# Altium schematic sheet PowerMeter_Cpu.SchDoc: Power Meter - CPU
size A4; Author: SFARA, Gonzalo Agustín; CompanyName: Introducción al Diseño de Circuitos Impresos; Organization: UTN FRBA; Revision: 02; SheetNumber: 4; SheetTotal: 5
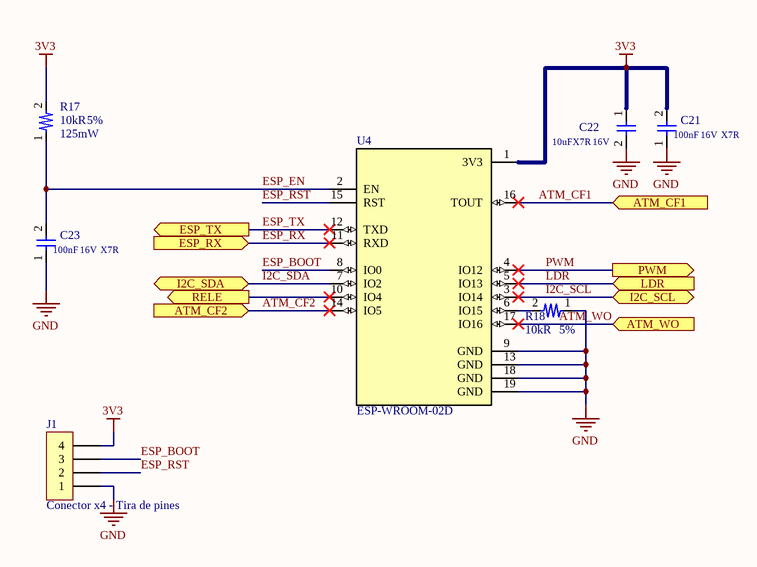
[diagram p0: PowerMeter_Cpu.SchDoc]

## Parts
C21  Capacitance: 100nF  Voltage Rating (DC): 16V  Dielectric: X7R  [C_0805]  (hidden comment: CAP Ceramic  0.1uF 16V X7R)
C22  Capacitance: 10uF  Dielectric: X7R  Voltage Rating: 16V  [C_1206]  (hidden comment: CAP Ceramic  10uF 16V X7R)
C23  Capacitance: 100nF  Voltage Rating (DC): 16V  Dielectric: X7R  [C_0805]  (hidden comment: CAP Ceramic  0.1uF 16V X7R)
J1  Conector x4 - Tira de pines  [Tira de pinesx4]
R17  Resistance: 10kR  Tolerance: 5%  Power Rating: 125mW  [R_0805]  (hidden comment: RES 10kOhm 5% 1/8W)
R18  Resistance: 10kR  Tolerance: 5%  [R_0805]  (hidden comment: RES 10kOhm 5% 1/8W)
U4  ESP-WROOM-02D  [ESP-WROOM-02D]

## Ports
ATM_CF1 (in), ATM_CF2 (in), ATM_WO (in), ESP_RX (in), ESP_TX (out), I2C_SCL (bidir), I2C_SDA (bidir), LDR (in), PWM (out), RELE (out)

## Nets
3V3: C21.2 C22.1 J1.4 R17.2 U4.1(3V3)
GND: C21.1 C22.2 C23.1 J1.1 R18.1 U4.9(GND) U4.13(GND) U4.18(GND) U4.19(GND)
ATM_CF1: U4.16(TOUT) ; port ATM_CF1
ATM_CF2: U4.14(IO5) ; port ATM_CF2
ATM_WO: U4.17(IO16) ; port ATM_WO
ESP_BOOT: J1.3 U4.8(IO0)
ESP_EN: C23.2 R17.1 U4.2(EN)
ESP_RST: J1.2 U4.15(RST)
ESP_RX: U4.11(RXD) ; port ESP_RX
ESP_TX: U4.12(TXD) ; port ESP_TX
I2C_SCL: U4.3(IO14) ; port I2C_SCL
I2C_SDA: U4.7(IO2) ; port I2C_SDA
LDR: U4.5(IO13) ; port LDR
PWM: U4.4(IO12) ; port PWM
RELE: U4.10(IO4) ; port RELE
NetR18_2: R18.2 U4.6(IO15)

## Notes on the sheet
- Title:
- Size:
- Author:
- A4
- Sheet
- of
- Revision:
- File:
- Date:

## Library data of the parts
C21 C23 = CAP_NP: Cap Ceramic 0.1uF 16V X7R 10% SMD 0805 125C Paper T/R; Manufacturer: Yageo; Manufacturer Part Number: CC0805KPX7R7BB104; Supplier 1: Digi-Key; Supplier Part Number 1: 13-CC0805KPX7R7BB104TR-ND; RoHS: Yes; Category: Ceramic Capacitors; Pricing 1: 60000=0,01497 (USD); Case/Package: 0805; Case Code (Imperial): 0805; Case Code (Metric): 2012; Weight: 0.000194oz; Min Operating Temperature: -55°C; Max Operating Temperature: 125°C; Tolerance: 10%; Packaging: Tape and Reel; Termination: SMD/SMT; Resistor Type: Ceramic; Lead Free: Lead Free; Halogen Free: Halogen Free; RoHS Compliant: Yes; ComponentLink1URL: https://datasheet.ciiva.com/13265/upy-gphc-x7r-6-3v-to-50v-8-12304-13265229.pdf?src-supplier=Mouser; ComponentLink1Description: https://datasheet.ciiva.com/13265/upy-gphc-x7r-6-3v-to-50v-8-12304-13265229.pdf?src-supplier=Mouser
C22 = CAP_NP: CL31 Series 1206 10 uF 16 V ±10% Tolerance X7R Multilayer Ceramic Capacitor; Manufacturer: Samsung; Manufacturer Part Number: CL31B106KOHNNNF; Value: *; Supplier 1: Future Electronics; Supplier Part Number 1: 5039552; RoHS: Yes; Category: Ceramic Capacitors; Stock 1: 2000; Pricing 1: 8000=0,04240, 16000=0,03440, 24000=0,03410, 32000=0,03390 (USD); Mount: Surface Mount; Case/Package: 1206; Min Operating Temperature: -55°C; Max Operating Temperature: 125°C; Tolerance: 10%; Packaging: Tape and Reel; Package Quantity: 8000; Voltage Rating (DC): 16V; Series: CL; Construction: Flat; Length: 3.2mm; Width: 0.063inch; Height: 1.6mm; Thickness: 0.071inch; Depth: 1.6mm; Radiation Hardening: No; Lead Free: Lead Free; RoHS Compliant: Yes; ComponentLink1URL: https://datasheet.ciiva.com/25728/cl31b106kohnnnf-25728936.pdf?src-supplier=Digi-Key; ComponentLink1Description: https://datasheet.ciiva.com/25728/cl31b106kohnnnf-25728936.pdf?src-supplier=Digi-Key
J1 = Conector x4
R17 = RES: Res Thick Film 0805 10K Ohm 5% 1/8W ±200ppm/°C Molded SMD SMD Paper T/R; Manufacturer: Vishay Dale; Manufacturer Part Number: CRCW080510K0JNEB; Voltage Rating: 150V; Supplier 1: Future Electronics; Supplier Part Number 1: 2941144; RoHS: Yes; Category: Chip SMD Resistors; Stock 1: 20000; Pricing 1: 10000=0,02140, 20000=0,01740, 30000=0,01730, 40000=0,01720, 50000=0,01710 (USD); Case/Package: 0805; Weight: 0.000194oz; Case Code (Imperial): 0805; Case Code (Metric): 2012; Contact Plating: Tin; Min Operating Temperature: -55°C; Max Operating Temperature: 155°C; Packaging: Tape and Reel; Package Quantity: 10000; Resistor Type: Thick Film; Termination: SMD/SMT; Number of Terminations: 2; Max Power Dissipation: 125mW; Temperature Coefficient: 200ppm/°C; Voltage Rating (DC): 150V; Working Voltage: 150V; Features: Automotive AEC-Q200; Series: CRCW; Construction: Rectangular; Technology: THICK FILM; Resistance Tolerance: 5%; Length: 2mm; Width: 1.25mm; Height: 0.02inch; Depth: 1.25mm; Radiation Hardening: No; REACH SVHC: Unknown; Military Standard: Not; Lead Free: Lead Free; ComponentLink1URL: https://datasheet.ciiva.com/3258/dcrcwe3-3258030.pdf?src-supplier=Avnet; ComponentLink1Description: https://datasheet.ciiva.com/3258/dcrcwe3-3258030.pdf?src-supplier=Avnet; ComponentLink2URL: https://datasheet.ciiva.com/16199/dcrcwe3-16199191.pdf?src-supplier=Future+Electronics; ComponentLink2Description: https://datasheet.ciiva.com/16199/dcrcwe3-16199191.pdf?src-supplier=Future+Electronics; ComponentLink3URL: https://datasheet.ciiva.com/7725/dcrcwe3-7725772.pdf?src-supplier=Element14; ComponentLink3Description: https://datasheet.ciiva.com/7725/dcrcwe3-7725772.pdf?src-supplier=Element14
R18 = RES: Res Thick Film 0805 10K Ohm 5% 1/8W ±200ppm/°C Molded SMD SMD Paper T/R; Manufacturer: Vishay Dale; Manufacturer Part Number: CRCW080510K0JNEB; Voltage Rating: 150V; Power Rating: 125mW; Supplier 1: Future Electronics; Supplier Part Number 1: 2941144; RoHS: Yes; Category: Chip SMD Resistors; Stock 1: 20000; Pricing 1: 10000=0,02140, 20000=0,01740, 30000=0,01730, 40000=0,01720, 50000=0,01710 (USD); Case/Package: 0805; Weight: 0.000194oz; Case Code (Imperial): 0805; Case Code (Metric): 2012; Contact Plating: Tin; Min Operating Temperature: -55°C; Max Operating Temperature: 155°C; Packaging: Tape and Reel; Package Quantity: 10000; Resistor Type: Thick Film; Termination: SMD/SMT; Number of Terminations: 2; Max Power Dissipation: 125mW; Temperature Coefficient: 200ppm/°C; Voltage Rating (DC): 150V; Working Voltage: 150V; Features: Automotive AEC-Q200; Series: CRCW; Construction: Rectangular; Technology: THICK FILM; Resistance Tolerance: 5%; Length: 2mm; Width: 1.25mm; Height: 0.02inch; Depth: 1.25mm; Radiation Hardening: No; REACH SVHC: Unknown; Military Standard: Not; Lead Free: Lead Free; ComponentLink1URL: https://datasheet.ciiva.com/3258/dcrcwe3-3258030.pdf?src-supplier=Avnet; ComponentLink1Description: https://datasheet.ciiva.com/3258/dcrcwe3-3258030.pdf?src-supplier=Avnet; ComponentLink2URL: https://datasheet.ciiva.com/16199/dcrcwe3-16199191.pdf?src-supplier=Future+Electronics; ComponentLink2Description: https://datasheet.ciiva.com/16199/dcrcwe3-16199191.pdf?src-supplier=Future+Electronics; ComponentLink3URL: https://datasheet.ciiva.com/7725/dcrcwe3-7725772.pdf?src-supplier=Element14; ComponentLink3Description: https://datasheet.ciiva.com/7725/dcrcwe3-7725772.pdf?src-supplier=Element14
U4 = ESP-WROOM-02D: Wi-Fi Module ESP8266EX SPI 2MB Flash UART w/ Antenna; MF: Espressif Systems; Frequency: 2.5GHz; Data Rate: 72.2Mbps; Sensitivity: -98dBm; Current - Transmitting: 170mA; Interface: I2C,GPIO,PWM,UART; Memory Size: 50KB; Value: *; SnapEDA_Link: https://www.snapeda.com/parts/ESP-WROOM-02D/Espressif%20Systems/view-part/2779866/?ref=snap; Availability: Unavailable; Price: None; Package: SMD-18 Espressif Systems; MP: ESP-WROOM-02D; Supplier 1: Digi-Key; Supplier Part Number 1: 1904-1021-1-ND; Manufacturer: Espressif Systems; Manufacturer Part Number: ESP-WROOM-02D; RoHS: No; Category: RF Receivers, Transceivers; Mount: Surface Mount; Case/Package: SMD/SMT; Min Operating Temperature: -40°C; Max Operating Temperature: 85°C; Packaging: Cut Tape; ComponentLink1URL: https://www.espressif.com/sites/default/files/documentation/esp-wroom-02d_esp-wroom-02u_datasheet_en.pdf?src-supplier=Digi-Key; ComponentLink1Description: https://www.espressif.com/sites/default/files/documentation/esp-wroom-02d_esp-wroom-02u_datasheet_en.pdf?src-supplier=Digi-Key